# Altium project PCB_Project.PrjPcb
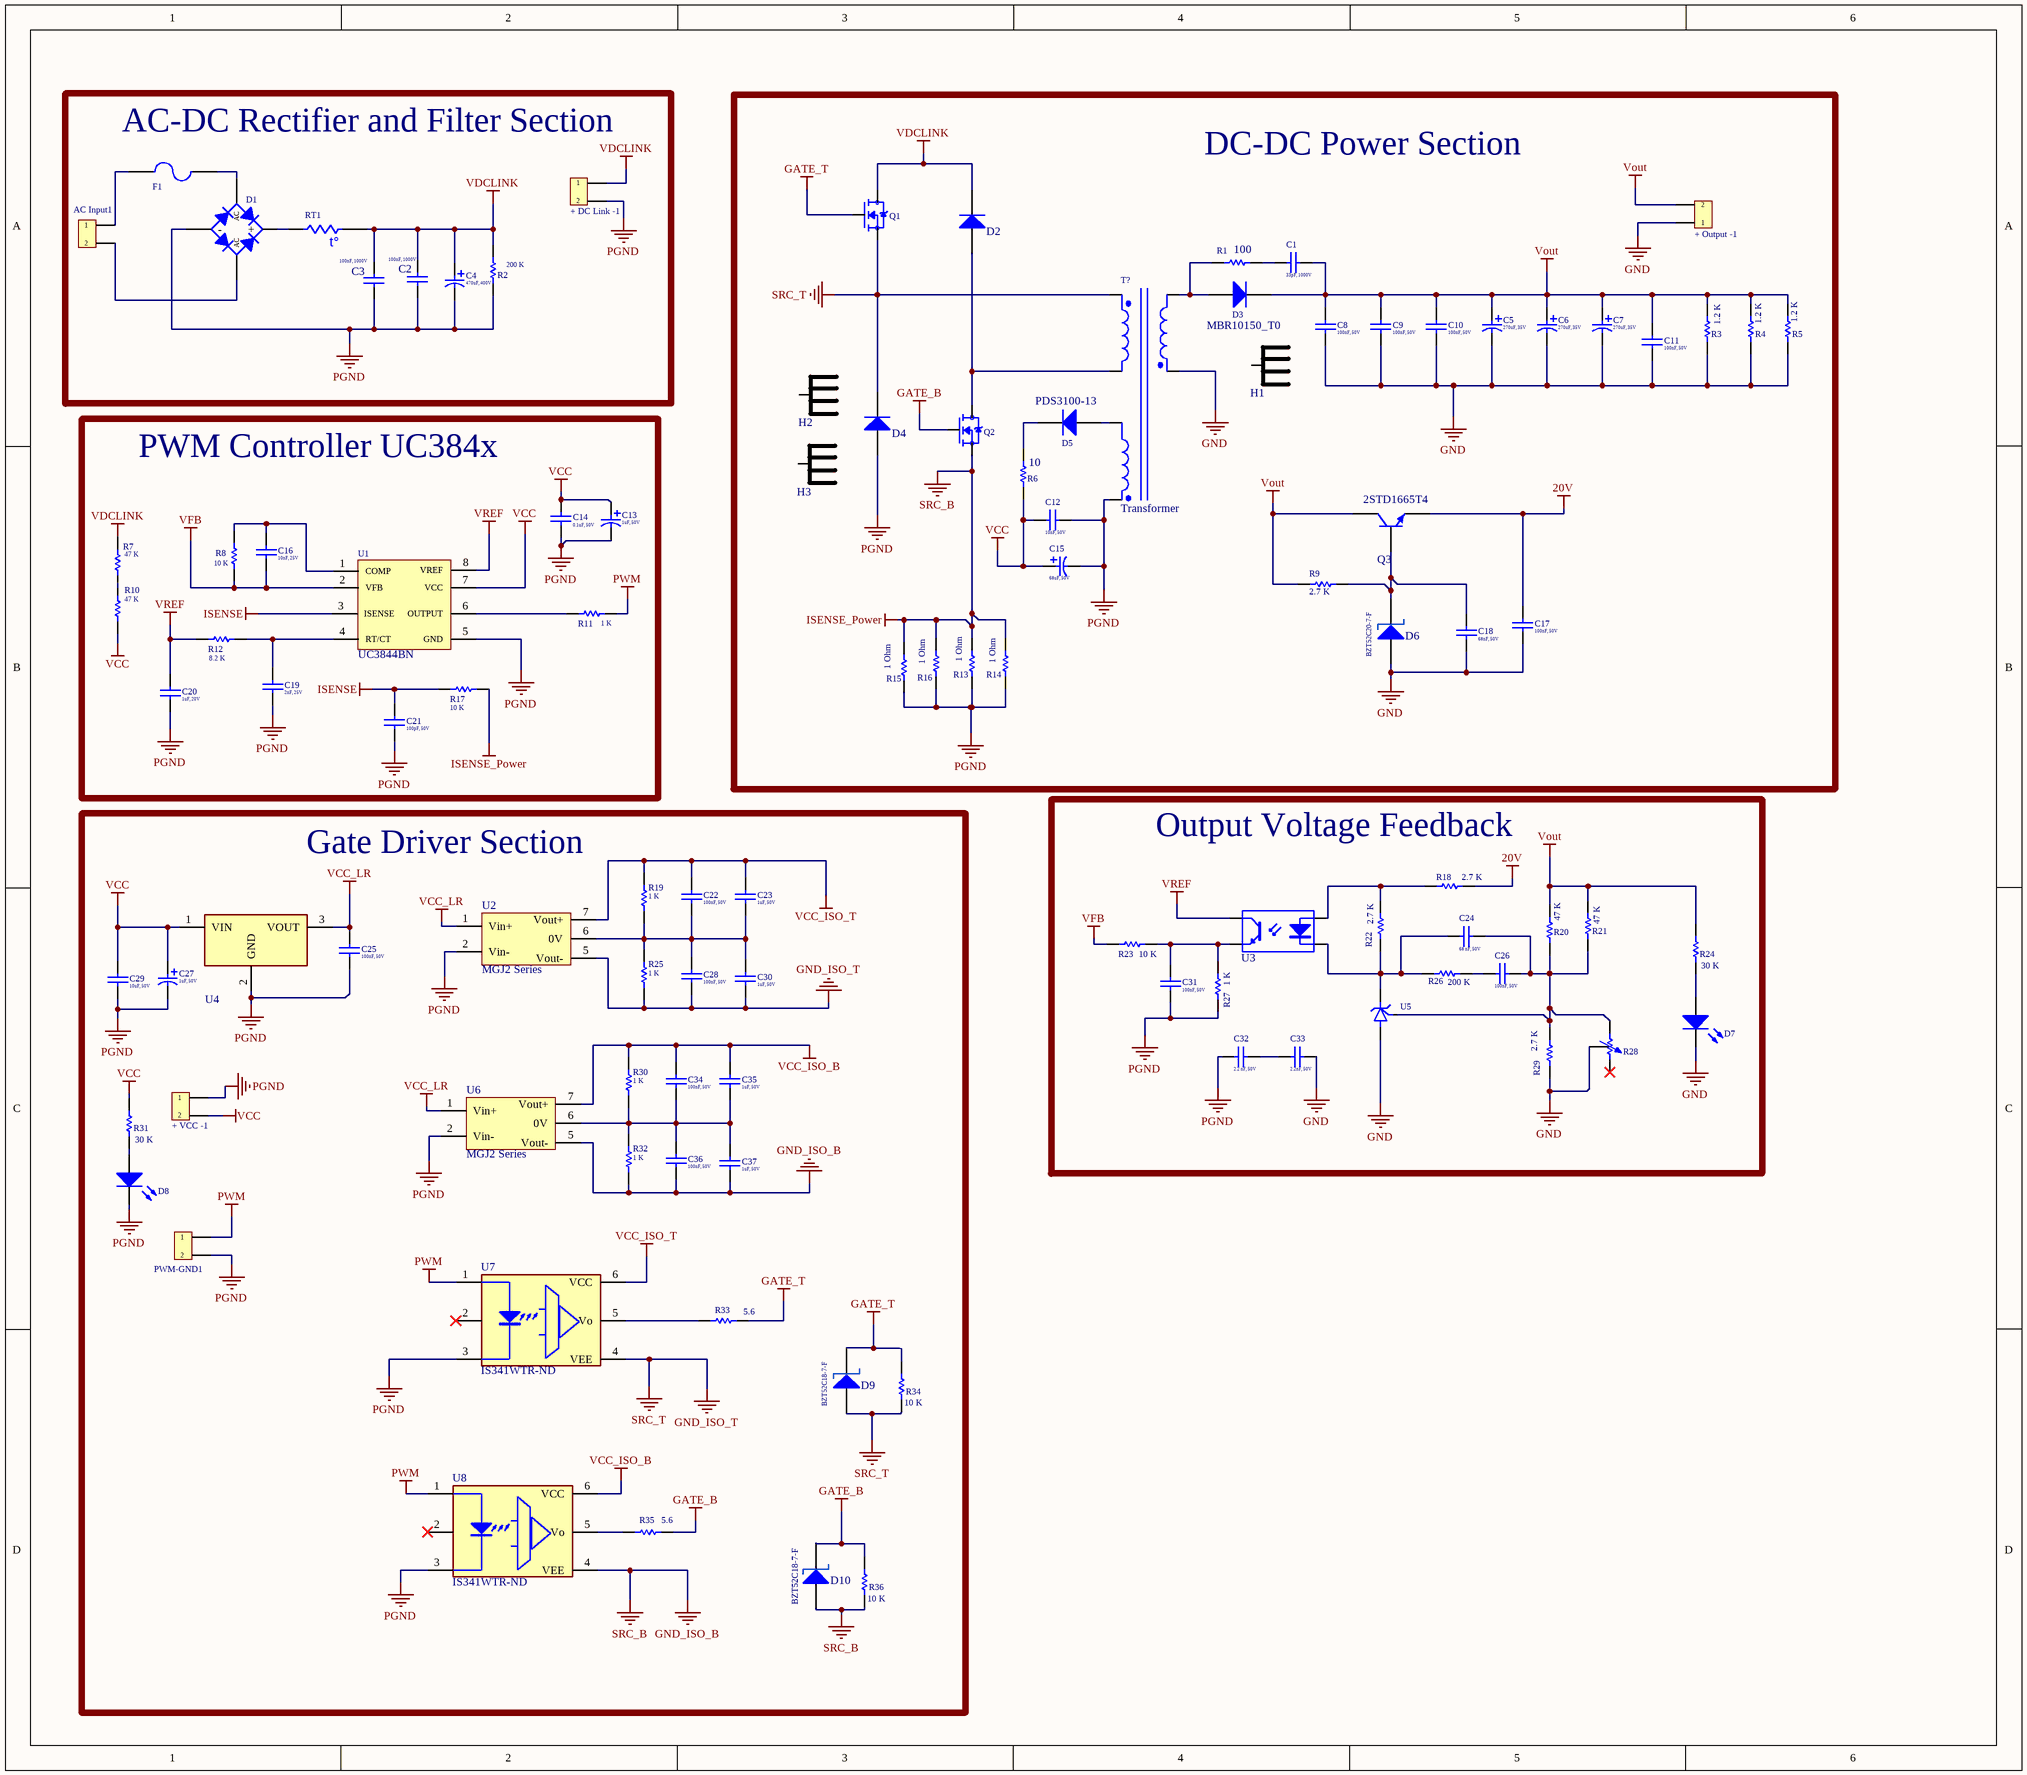
[diagram p0: Sheet1.SchDoc]
1 sheet, 105 parts. Net scope: global (net labels, ports and power ports of the same name join across sheets).
Board file: PCBV2.PcbDoc

## Sheet Sheet1.SchDoc
size 400 x 350 mm; SheetNumber: 1; SheetTotal: 1

### Parts
+_DC_Link_-1  732-2088-ND  [Connector 1x3 5.08mm]  (value not drawn)
+_Output_-1  732-2088-ND  [Connector 1x2 5.08mm]  (value not drawn)
+_VCC_-1  732-2088-ND  [Connector 1x2 5.08mm]  (value not drawn)
AC_Input1  732-2088-ND  [Connector 1x3 5.08mm]  (value not drawn)
C1  value 33pF, 1000V  [Capacitor Polyester High Voltage DIP]  (hidden comment: (DIGIKEY Part Number))
C2  value 100nF, 1000V  [Capacitor Film DIP 04]  (hidden comment: CBB23)
C3  value 100nF, 1000V  [Capacitor Film DIP 04]  (hidden comment: CBB23)
C4  value 470uF, 400V  [Capacitor Aluminum Electrolytic DIP 20*36.5*10]  (hidden comment: 493-2587-ND)
C5  value 270uF, 35V  [Capacitor Aluminum Electrolytic DIP 10*13*5]  (hidden comment: UHV1V271MPD1TA-ND)
C6  value 270uF, 35V  [Capacitor Aluminum Electrolytic DIP 10*13*5]  (hidden comment: UHV1V271MPD1TA-ND)
C7  value 270uF, 35V  [Capacitor Aluminum Electrolytic DIP 10*13*5]  (hidden comment: UHV1V271MPD1TA-ND)
C8  value 100nF, 50V  [Capacitor Ceramic SMD 1206]  (hidden comment: 478-KGM21NR71H104JTTR-ND)
C9  value 100nF, 50V  [Capacitor Ceramic SMD 1206]  (hidden comment: 478-KGM21NR71H104JTTR-ND)
C10  value 100nF, 50V  [Capacitor Ceramic SMD 1206]  (hidden comment: 478-KGM21NR71H104JTTR-ND)
C11  value 100nF, 50V  [Capacitor Film DIP 06]  (hidden comment: 478-KGM21NR71H104JTTR-ND)
C12  value 10nF, 50V  [Capacitor Ceramic SMD 805]  (hidden comment: GRM2195C1H103JA01D)
C13  value 1uF, 50V  [Capacitor Aluminum Electrolytic DIP 5*7.5*2.5]  (hidden comment: 732-8851-1-ND)
C14  value 0.1uF, 50V  [Capacitor Ceramic SMD 805]  (hidden comment: 399-C0805C104J5RAC7800TR-ND)
C15  value 68uF, 50V  [Capacitor Aluminum Electrolytic DIP 5*7.5*2.5]  (hidden comment: P15139-ND)
C16  value 10nF, 25V  [Capacitor Ceramic SMD 805]  (hidden comment: 490-1642-2-ND)
C17  value 100nF, 50V  [Capacitor Ceramic SMD 805]  (hidden comment: 478-KGM21NR71H104JTTR-ND)
C18  value 68nF, 50V  [Capacitor Ceramic SMD 805]  (hidden comment: KGM21NR71H683JT)
C19  value 2nF, 25V  [Capacitor Ceramic SMD 805]  (hidden comment: 490-1627-2-ND)
C20  value 1uF, 20V  [Capacitor Ceramic SMD 805]  (hidden comment: 311-3498-2-ND)
C21  value 100pF, 50V  [Capacitor Ceramic SMD 805]  (hidden comment: 399-C0805C101J5GAC7800TR-ND)
C22  value 100nF, 50V  [Capacitor Ceramic SMD 805]  (hidden comment: C0805C104J5RAC7800)
C23  value 1uF, 50V  [Capacitor Ceramic SMD 805]  (hidden comment: CC0805JKX7R9BB105)
C24  value 68 nF, 50V  [Capacitor Ceramic SMD 805]  (hidden comment: KGM21NR71H683JT)
C25  value 100nF, 50V  [Capacitor Ceramic SMD 805]  (hidden comment: C0805C104J5RAC7800)
C26  value 100nF, 50V  [Capacitor Ceramic SMD 805]  (hidden comment: C0805C104J5RAC7800)
C27  value 1uF, 50V  [Capacitor Aluminum Electrolytic DIP 5*7.5*2.5]  (hidden comment: 732-8851-1-ND)
C28  value 100nF, 50V  [Capacitor Ceramic SMD 805]  (hidden comment: C0805C104J5RAC7800)
C29  value 10uF, 50V  [Capacitor Ceramic SMD 805]  (hidden comment: 490-18663-2-ND)
C30  value 1uF, 50V  [Capacitor Ceramic SMD 805]  (hidden comment: CC0805JKX7R9BB105)
C31  value 100nF, 50V  [Capacitor Ceramic SMD 805]  (hidden comment: C0805C104J5RAC7800)
C32  value 2.2 nF, 50V  [Capacitor Polyester High Voltage DIP]  (hidden comment: (DIGIKEY Part Number))
C33  value 2.2nF, 50V  [Capacitor Polyester High Voltage DIP]  (hidden comment: (DIGIKEY Part Number))
C34  value 100nF, 50V  [Capacitor Ceramic SMD 805]  (hidden comment: C0805C104J5RAC7800)
C35  value 1uF, 50V  [Capacitor Ceramic SMD 805]  (hidden comment: CC0805JKX7R9BB105)
C36  value 100nF, 50V  [Capacitor Ceramic SMD 805]  (hidden comment: C0805C104J5RAC7800)
C37  value 1uF, 50V  [Capacitor Ceramic SMD 805]  (hidden comment: CC0805JKX7R9BB105)
D1  31-GBU10V08-TU-ND  [Bridge Rectifier 1Phase 600V 10A GBJ]  (value not drawn)
D2  DSEP6-06AS-TRL  [Diode SMD TO-252 (DPAK)]  (value not drawn)
D3  MBR10150_T0  [Diode DIP ITO-220AC]
D4  DSEP6-06AS-TRL  [Diode SMD TO-252 (DPAK)]  (value not drawn)
D5  PDS3100-13  [Diode SMD POWERDI5]
D6  BZT52C20-7-F  [Diode Zener SMD DO-214AC]
D7  L62505TR-ND  [LED SMD 805 01]  (value not drawn)
D8  L62505TR-ND  [LED SMD 805 01]  (value not drawn)
D9  BZT52C18-7-F  [Diode Zener SMD DO-214AC]
D10  BZT52C18-7-F  [Diode Zener SMD DO-214AC]
F1  F1730-ND  [Fuse Full DIP 02]  (value not drawn)
H1  (DIGIKEY Part Number)  [HEATSINK 05]  (value not drawn)
H2  (DIGIKEY Part Number)  [HEATSINK 05]  (value not drawn)
H3  (DIGIKEY Part Number)  [HEATSINK 05]  (value not drawn)
PWM-GND1  A105225-ND  [Header 01 1x2]  (value not drawn)
Q1  IPP50R280CEXKSA1-ND  [MOSFET DIP TO-220]  (value not drawn)
Q2  IPP50R280CEXKSA1-ND  [MOSFET DIP TO-220]  (value not drawn)
Q3  2STD1665T4  [BJT NPN SMD DPAK TO-252]
R1  value 100  [Resistor DIP 0.25W 01]  (hidden comment: (DIGIKEY Part Number))
R2  value 200 K  [Resistor DIP 0.25W 01]  (hidden comment: P200KDATR-ND)
R3  value 1.2 K  [Resistor SMD 1206]  (hidden comment: RMCF2010JT1K20)
R4  value 1.2 K  [Resistor SMD 1206]  (hidden comment: RMCF2010JT1K20)
R5  value 1.2 K  [Resistor SMD 1206]  (hidden comment: RMCF2010JT1K20)
R6  value 10  [Resistor SMD 805]  (hidden comment: (DIGIKEY Part Number))
R7  value 47 K  [Resistor SMD 805]  (hidden comment: P47KDATR-ND)
R8  value 10 K  [Resistor SMD 805]  (hidden comment: RG20P10.0KBTR-ND)
R9  value 2.7 K  [Resistor SMD 805]  (hidden comment: P2.7KDATR-ND)
R10  value 47 K  [Resistor SMD 805]  (hidden comment: P47KDATR-ND)
R11  value 1 K  [Resistor SMD 805]  (hidden comment: TC0525B1001T5G)
R12  value 8.2 K  [Resistor SMD 805]  (hidden comment: TC0550D8201T5F)
R13  value 1 Ohm  [Resistor SMD 2512]  (hidden comment: 13-RT1206BRE071RL-ND)
R14  value 1 Ohm  [Resistor SMD 2512]  (hidden comment: 13-RT1206BRE071RL-ND)
R15  value 1 Ohm  [Resistor SMD 2512]  (hidden comment: 13-RT1206BRE071RL-ND)
R16  value 1 Ohm  [Resistor SMD 2512]  (hidden comment: 13-RT1206BRE071RL-ND)
R17  value 10 K  [Resistor SMD 805]  (hidden comment: RG20P10.0KBTR-ND)
R18  value 2.7 K  [Resistor SMD 805]  (hidden comment: P2.7KDATR-ND)
R19  value 1 K  [Resistor SMD 805]  (hidden comment: TC0525B1001T5G)
R20  value 47 K  [Resistor SMD 805]  (hidden comment: ERA-6AEB473V)
R21  value 47 K  [Resistor SMD 805]  (hidden comment: ERA-6AEB473V)
R22  value 2.7 K  [Resistor SMD 805]  (hidden comment: P2.7KDATR-ND)
R23  value 10 K  [Resistor SMD 805]  (hidden comment: RG20P10.0KBTR-ND)
R24  value 30 K  [Resistor SMD 805]  (hidden comment: ERJ-P06F3002V-)
R25  value 1 K  [Resistor SMD 805]  (hidden comment: TC0525B1001T5G)
R26  value 200 K  [Resistor SMD 805]  (hidden comment: P200KDATR-ND)
R27  value 1 K  [Resistor SMD 805]  (hidden comment: ERA-6AEB102V)
R28  (DIGIKEY Part Number)  [Resistor Variable DIP 02]  (value not drawn)
R29  value 2.7 K  [Resistor SMD 805]  (hidden comment: ERA-6AEB272V)
R30  value 1 K  [Resistor SMD 805]  (hidden comment: TC0525B1001T5G)
R31  value 30 K  [Resistor SMD 805]  (hidden comment: ERJ-P06F3002V-)
R32  value 1 K  [Resistor SMD 805]  (hidden comment: TC0525B1001T5G)
R33  value 5.6  [Resistor SMD 1206 MELF 01]  (hidden comment: 749-1374-2-ND)
R34  value 10 K  [Resistor SMD 805]  (hidden comment: RG2012P-103-B-T5)
R35  value 5.6  [Resistor SMD 1206 MELF 01]  (hidden comment: 749-1374-2-ND)
R36  value 10 K  [Resistor SMD 805]  (hidden comment: RG2012P-103-B-T5)
RT1  118-BN-LG10Y2R0MYB-ND  [NTC Thermistor DIP 01]  (value not drawn)
T?  Transformer  [CustomTransformer-ELE713]
U1  UC3844BN  [PWM Controller UC3844 DIP 01]
U2  MGJ2 Series  [Linear Regulator Isolated Module DC-DC DIP 02]
U3  PS2501-1-H-A  [Optoisolators DIP 01]  (value not drawn)
U4  LM2940SX-12/NOPBTR-ND  [D2PAK]  (value not drawn)
U5  (DIGIKEY Part Number)  [TL431 DIP]  (value not drawn)
U6  MGJ2 Series  [Linear Regulator Isolated Module DC-DC DIP 02]
U7  IS341WTR-ND  [Gate Driver IS341W SO6 Stretched]
U8  IS341WTR-ND  [Gate Driver IS341W SO6 Stretched]

### Blocks framed on the sheet
AC-DC Rectifier and Filter Section: +_DC_Link_-1 AC_Input1 C2-C4 D1 F1 R2 RT1
DC-DC Power Section: +_Output_-1 C1 C5-C12 C15 C17 C18 D2-D6 H1-H3 Q1-Q3 R1 R3-R6 R9 R13-R16 T?
PWM Controller UC384x: C13 C14 C16 C19-C21 R7 R8 R10-R12 R17 U1
Gate Driver Section: +_VCC_-1 C22 C23 C25 C27-C30 C34-C37 D8-D10 PWM-GND1 R19 R25 R30-R36 U2 U4 U6-U8
Output Voltage Feedback: C24 C26 C31-C33 D7 R18 R20-R24 R26-R29 U3 U5

### Nets
20V: C17.2 Q3.2(E) R18.1
GATE_B: D10.2(K) Q2.1(G) R35.1 R36.1
GATE_T: D9.2(K) Q1.1(G) R33.1 R34.1
GND: +_Output_-1.1 C5.2 C6.2 C7.2 C8.1 C9.1 C10.1 C11.1 C17.1 C18.1 C33.2 D6.1(A) D7.2(K) R3.2 R4.2 R5.2 R28.2 R29.2 T?.6 U5.2(A)
GND_ISO_B: C36.1 C37.1 D10.1(A) Q2.3(S) R13.2 R14.2 R15.2 R16.2 R17.1 R32.1 R36.2 U6.5(Vout-) U8.4(VEE)  [also labelled ISENSE_Power, SRC_B]
GND_ISO_T: C28.1 C30.1 D4.2(K) D9.1(A) Q1.3(S) R25.1 R34.2 T?.1 U2.5(Vout-) U7.4(VEE)  [also labelled SRC_T]
ISENSE: C21.2 R17.2 U1.3(ISENSE)
PGND: +_DC_Link_-1.2 +_VCC_-1.1 C2.1 C3.1 C4.2 C12.1 C13.2 C14.1 C15.2 C19.1 C20.1 C21.1 C25.1 C27.2 C29.1 C31.2 C32.1 D1.3(-) D4.1(A) D8.2(K) PWM-GND1.2 R2.2 R13.1 R14.1 R15.1 R16.1 R27.2 T?.4 U1.5(GND) U2.2(Vin-) U4.2(GND) U6.2(Vin-) U7.3 U8.3
PWM: PWM-GND1.1 R11.2 U7.1 U8.1
VCC: +_VCC_-1.2 C12.2 C13.1 C14.2 C15.1 C27.1 C29.2 R6.2 R10.2 R31.1 U1.7(VCC) U4.1(VIN)
VCC_ISO_B: C34.2 C35.2 R30.2 U6.7(Vout+) U8.6(VCC)
VCC_ISO_T: C22.2 C23.2 R19.2 U2.7(Vout+) U7.6(VCC)
VCC_LR: C25.2 U2.1(Vin+) U4.3(VOUT) U6.1(Vin+)
VDCLINK: +_DC_Link_-1.1 C2.2 C3.2 C4.1 D2.2(K) Q1.2(D) R2.1 R7.1 RT1.2
VFB: C16.1 R8.1 R23.1 U1.2(VFB)
Vout: +_Output_-1.2 C1.1 C5.1 C6.1 C7.1 C8.2 C9.2 C10.2 C11.2 D3.2(K) Q3.3(C) R3.1 R4.1 R5.1 R9.1 R20.1 R21.1 R24.1
VREF: C20.2 R12.2 U1.8(VREF) U3.4(C)
NetAC_Input1_1: AC_Input1.1 F1.1
NetAC_Input1_2: AC_Input1.2 D1.2(AC)
NetC1_2: C1.2 R1.1
NetC16_2: C16.2 R8.2 U1.1(COMP)
NetC18_2: C18.2 D6.2(K) Q3.1(B) R9.2
NetC19_2: C19.2 R12.1 U1.4(RT/CT)
NetC22_1: C22.1 C23.1 C28.2 C30.2 R19.1 R25.2 U2.6(0V)
NetC24_1: C24.1 C26.1 R20.2 R21.2 R28.1 R29.1 U5.1(REF)
NetC24_2: C24.2 R22.2 R26.1 U3.2(K) U5.3(C)
NetC26_2: C26.2 R26.2
NetC31_1: C31.1 R23.2 R27.1 U3.3(E)
NetC32_2: C32.2 C33.1
NetC34_1: C34.1 C35.1 C36.2 C37.2 R30.1 R32.2 U6.6(0V)
NetD1_1: D1.1(AC) F1.2
NetD1_4: D1.4(+) RT1.1
NetD2_1: D2.1(A) Q2.2(D) T?.2
NetD3_1: D3.1(A) R1.2 T?.5
NetD5_1: D5.1(A) T?.3
NetD5_2: D5.2(K) R6.1
NetD7_1: D7.1(A) R24.2
NetD8_1: D8.1(A) R31.2
NetR7_2: R7.2 R10.1
NetR11_1: R11.1 U1.6(OUTPUT)
NetR18_2: R18.2 R22.1 U3.1(A)
NetR33_2: R33.2 U7.5(Vo)
NetR35_2: R35.2 U8.5(Vo)

Not connected (* = marked no-connect by the designer): R28 3*; U7 2*; U8 2*

### Notes on the sheet
- (in symbol NTC) t°

### Library data of the parts
+_DC_Link_-1 +_Output_-1 +_VCC_-1 AC_Input1 PWM-GND1 = Contact-Phoenix 2x: Manufacturer: Phoenix Contact; Manufacturer Part Number: 1715721; Max Current Rating: 22A; Number of Poles: 2; Voltage Rating: 400V; Max Supply Voltage: 250V; Current Rating: 17.5A; Number of Levels: 1; Current: 15A; Voltage: 300V; Connector Type: Screw,Terminal Block,PCB; Test Voltage: 4kV; Wire Gauge (Max): 26AWG; Wire/Cable Gauge: 14AWG; Pitch: 5.08mm; Stripping Length: 7mm; Approvals: UL,CSA,cULus,EAC; Supplier 1: Digi-Key; RoHS: Yes; Category: Terminal Blocks; Stock 1: 4962; Pricing 1: 1=1.39000, 10=1.33400, 50=1.27600, 100=1.24120, 250=1.16000, 500=1.06720, 1000=0.98600, 2500=0.93960, 5000=0.89320 (USD); Mount: Through Hole; Number of Pins: 2; Color: Green; Weight: 0.103705oz; Housing Color: Green; Housing Material: Polyamide; Insulation Material: Nylon; Contact Material: Tin; Min Operating Temperature: -20°C; Max Operating Temperature: 100°C; Number of Rows: 1; Package Quantity: 50; Voltage Rating (AC): 250V; Packaging: Bulk; Number of Positions: 2; Termination: Screw; Number of Positions Per Level: 2; Number of Contacts: 2; Number of Circuits: 2; Orientation: Straight; Series: MKDS; Length: 10.16mm; Width: 17.3mm; Height: 17.3mm; Wire Gauge (Min): 26AWG; Depth: 9.8mm; Radiation Hardening: No; REACH SVHC: No SVHC; Lead Free: Lead Free; Flammability Rating: UL94 V-0; RoHS Compliant: Yes; ComponentLink1URL: https://datasheet.ciiva.com/16046/1715721-16046034.pdf?src-supplier=Onlinecomponents.com; ComponentLink1Description: https://datasheet.ciiva.com/16046/1715721-16046034.pdf?src-supplier=Onlinecomponents.com; ComponentLink2URL: https://datasheet.ciiva.com/1120/1697161-1120393.pdf?src-supplier=Farnell; ComponentLink2Description: https://datasheet.ciiva.com/1120/1697161-1120393.pdf?src-supplier=Farnell; ComponentLink3URL: https://datasheet.ciiva.com/15169/getdatasheetpartid-212174-15169929.pdf?src-supplier=Verical; ComponentLink3Description: https://datasheet.ciiva.com/15169/getdatasheetpartid-212174-15169929.pdf?src-supplier=Verical; ComponentLink4URL: https://datasheet.ciiva.com/832/1715721-832095.pdf?src-supplier=Digi-Key; ComponentLink4Description: https://datasheet.ciiva.com/832/1715721-832095.pdf?src-supplier=Digi-Key; Supplier Part Number 1: 277-1263-ND
C1-C3 C8-C12 C14 C16-C26 C28-C37 = Capacitors Non-Electrolytic: Ceramic & Polyester Capacitor
C4-C7 C13 C15 C27 = Capacitors Electrolytic: Aluminum Electrolytic Capacitors; MF: Nichicon; MP: UVR2A471MHD; Price: None; Package: Radial Nichicon; SnapEDA_Link: https://www.snapeda.com/parts/UVR2A471MHD/Nichicon/view-part/2302933/?ref=snap; Availability: Unavailable; Supplier 1: Digi-Key; Supplier Part Number 1: 1189-2012-ND
D1 = Single Phase Bridge Rectifier: Bridge Rectifier Single Phase Standard; Published: 8-Jun-2000; LatestRevisionDate: 29-May-2009; LatestRevisionNote: Sch pins A & K swapped.; DatasheetVersion: E2732B; PackageReference: D-38; Publisher: Altium Limited; PackageDescription: Bridge Rectifier; 4 Terminals; Body 9.4 x 9.4 mm (typ); Pitch 5.08 mm; Supplier 1: Future Electronics; Supplier Part Number 1: 6113720
D2-D5 = Diode: Through Hole & SMD Diode; Published: 8-Jun-2000; LatestRevisionDate: 17-Jul-2002; LatestRevisionNote: Re-released for DXP Platform.; DatasheetVersion: Aug-1984; PackageReference: DO-201AD; Publisher: Altium Limited; PackageDescription: Diode, Axial; Body 9.5 x 5.3 mm (LxDia. max), Lead Dia. 1.32 mm (max); ComponentLink1Description: Manufacturer Link; ComponentLink1URL: http://www.irf.com/
D6 D9 D10 = Diode Zener: Through Hole & SMD Zener Diode; Note: Terminal 2 is the TAB and is electrically connected to the cathode; Published: 8-Jun-2000; LatestRevisionDate: 17-Jul-2002; LatestRevisionNote: Re-released for DXP Platform.; DatasheetVersion: Dec-1997; PackageVersion: Feb-1998; PackageReference: TO-220AC; Publisher: Altium Limited; PackageDescription: TO, Thru-Hole, Vertical, Heatsink Mounted; 3 In-Line Leads (1 Absent); Pitch 2.54 mm; ComponentLink1Description: Manufacturer Link; ComponentLink1URL: http://www.irf.com/; ComponentLink2Description: Datasheet; ComponentLink2URL: http://www.irf.com/product-info/datasheets/data/18tq.pdf
D7 D8 = LED: Typical RED, GREEN, YELLOW, AMBER GaAs LED; Published: 8-Jun-2000; LatestRevisionDate: 17-Jul-2002; LatestRevisionNote: Re-released for DXP Platform.; PackageVersion: Feb-2002; PackageReference: 3.2X1.6X1.1; Publisher: Altium Limited; PackageDescription: SM LED; 2 Flat Leads
F1 = Fuse: Fuse, Circuit Protection; Published: 8-Jun-2000; LatestRevisionDate: 17-Jul-2002; LatestRevisionNote: Re-released for DXP Platform.; PackageReference: PIN-W2/E2.8; Publisher: Altium Limited; PackageDescription: Thru-Hole; 2 Leads; Supplier 1: Digi-Key; Supplier Part Number 1: 031501.2HXP-ND
H1-H3 = Heat Sink: Heat Sink TO-220 Aluminum 20.0W @ 60Â°C Board Level, Vertical; MP: 530002B02500G; MF: Aavid Thermalloy; Value: *; SnapEDA_Link: https://www.snapeda.com/parts/530002B02500G/Aavid+Thermalloy/view-part/?ref=snap; Purchase-URL: https://pricing.snapeda.com/search/part/530002B02500G/?ref=eda; Check_prices: https://www.snapeda.com/parts/530002B02500G/Aavid+Thermalloy/view-part/?ref=eda; Availability: In Stock; Price: None; Package: None
Q1 Q2 = Transistor MOSFET: N-Channel MOSFET; MP: FDN360P; MF: ON Semiconductor; Check_prices: https://www.snapeda.com/parts/FDN360P/ON%20Semiconductor/view-part/2105995/?ref=eda; Price: None; Purchase-URL: https://pricing.snapeda.com/search/part/FDN360P/?ref=eda; Availability: Good; Package: SC-59 ON Semiconductor; SnapEDA_Link: https://www.snapeda.com/parts/FDN360P/ON%20Semiconductor/view-part/2105995/?ref=snap; Value: *
Q3 = Transistor BJT: NPN General Purpose BJT; Published: 8-Jun-2000; LatestRevisionDate: 15-Jan-2003; LatestRevisionNote: PCB Footprint 'BCY-W3/D4.7' replaced; DatasheetVersion: 1997; PackageVersion: Sep-1998; PackageReference: TO-92A; Publisher: Altium Limited; PackageDescription: TO, Flat Index; 3 In-Line, Axial Leads; Body Dia. 4.5mm; Leads 0.51 x 0.48 mm (max); ComponentLink1Description: Manufacturer Link; ComponentLink1URL: http://www.fairchildsemi.com/; ComponentLink2Description: Datasheet; ComponentLink2URL: http://www.fairchildsemi.com/ds/2N%2F2N3904.pdf
R1-R27 R29-R36 = Resistor: Through Hole & SMD; Published: 8-Jun-2000; LatestRevisionDate: 17-Jul-2002; LatestRevisionNote: Re-released for DXP Platform.; PackageReference: AXIAL-0.3; Publisher: Altium Limited; PackageDescription: Axial Device, Thru-Hole; 2 Leads; 0.3 in Pin Spacing
R28 = Resistor Variable: Trimmer Potentiometer Cermet Top Adjustment; Set Position: 0.5; Value: 20K; Published: 8-Jun-2000; LatestRevisionDate: 17-Jul-2002; LatestRevisionNote: Re-released for DXP Platform.; PackageReference: AXIAL-0.7; Publisher: Altium Limited; PackageDescription: Axial Device, Thru-Hole; 2 Leads; 0.7 in Pin Spacing; Supplier 1: Digi-Key; Supplier Part Number 1: 3252W-103LF-ND
RT1 = NTC: NTC Thermistor; Published: 24-Mar-1999; LatestRevisionDate: 29-May-2009; LatestRevisionNote: IPC-7351 Footprint Added.; PackageVersion: Mar-2003; PackageReference: 6-0805; Publisher: Altium Limited; PackageDescription: Chip Resistor 0805 Case Size; Code_IPC: RESC2012; Supplier 1: Digi-Key; Supplier Part Number 1: 495-76311-ND
T? = EE42/21/20: Custom Transformer; Published: 25-Jan-2001; LatestRevisionDate: 17-Jul-2002; LatestRevisionNote: Re-released for DXP Platform.; PackageReference: TRF_8; Publisher: Altium Limited; PackageDescription: Transformer; 8 Leads
U1 = PWM Controller UC3844BN: Off-Line Controllers 52kHz 1A Current PWM No-Cancel/No-Return; Manufacturer: STMicroelectronics; Supplier: Mouser; Supplier Part Number: 511-UC3844BN; Manufacturer Part Number: UC3844BN; RoHS: Yes; Category: Voltage Regulators - Switching; Stock: 11981; Pricing: 1=0.71, 10=0.501, 50=0.501, 100=0.46, 1000=0.414, 10000=0.38 (USD); ComponentLink1URL: https://datasheet.ciiva.com/15108/getdatasheetpartid-119240-15108173.pdf?src-supplier=Verical; ComponentLink1Description: https://datasheet.ciiva.com/15108/getdatasheetpartid-119240-15108173.pdf?src-supplier=Verical; ComponentLink2URL: https://datasheet.ciiva.com/4875/cd00000966-105506-4875760.pdf?src-supplier=Mouser; ComponentLink2Description: https://datasheet.ciiva.com/4875/cd00000966-105506-4875760.pdf?src-supplier=Mouser; ComponentLink3URL: https://datasheet.ciiva.com/17091/0900766b80ed226c-17091155.pdf?src-supplier=Allied+Electronics; ComponentLink3Description: https://datasheet.ciiva.com/17091/0900766b80ed226c-17091155.pdf?src-supplier=Allied+Electronics; ComponentLink4URL: https://datasheet.ciiva.com/2015/cd00000966-2015458.pdf?src-supplier=Digikey; ComponentLink4Description: https://datasheet.ciiva.com/2015/cd00000966-2015458.pdf?src-supplier=Digikey; ComponentLink5URL: https://datasheet.ciiva.com/2015/cd00000966-2015459.pdf?src-supplier=Digikey; ComponentLink5Description: https://datasheet.ciiva.com/2015/cd00000966-2015459.pdf?src-supplier=Digikey; ComponentLink6URL: https://datasheet.ciiva.com/8197/cd00000966-8197558.pdf?src-supplier=Avnet; ComponentLink6Description: https://datasheet.ciiva.com/8197/cd00000966-8197558.pdf?src-supplier=Avnet; ComponentLink7URL: https://datasheet.ciiva.com/16361/cd00000966-16361433.pdf?src-supplier=Future+Electronics; ComponentLink7Description: https://datasheet.ciiva.com/16361/cd00000966-16361433.pdf?src-supplier=Future+Electronics
U2 U6 = Linear Regulator Isolated Module MGJ: Module DC-DC 12VIN 2-OUT 15V/-5V 0.08A/0.04A 2W 5-Pin SIP Module; Manufacturer: Murata; Manufacturer Part Number: MGJ2D121505SC; Max Input Voltage: 13.2V; Min Input Voltage: 10.8V; Number of Outputs: 2; Voltage - Output 1: 15V; Voltage - Output 2: -5V; Max Output Current: 40mA; Isolation Voltage: 5.2kV; Efficiency: 80%; Current - Output 1: 80mA; Nominal Input Voltage: 12V; Max Power Dissipation: 1W; Stock 1: 0; Pricing 1: 1=8.46, 5=8.42, 10=8.36, 25=8.27, 50=8.06, 100=7.66, 250=7.17, 500=6.68, 1000=6.65 (USD); Mount: Through Hole; Case/Package: SIP; Number of Pins: 5; Weight: 0.151678oz; Min Operating Temperature: -40°C; Max Operating Temperature: 100°C; Packaging: Rail/Tube; Output Power: 2W; Max Input Voltage (DC): 13.2V; Min Input Voltage (DC): 10.8V; Max Output Power: 2W; Current - Output 2: 40mA; Output Voltage: 15V; Output Current: 80mA; Package Quantity: 25; Features: SCP; Length: 0.77inch; Width: 0.39inch; Height: 0.5inch; Depth: 19.65mm; Radiation Hardening: No; REACH SVHC: No SVHC; RoHS Compliant: Yes; ComponentLink1URL: http://www.farnell.com/datasheets/1965123.pdf?src-supplier=Element14; ComponentLink1Description: http://www.farnell.com/datasheets/1965123.pdf?src-supplier=Element14; ComponentLink2URL: http://power.murata.com/data/power/ncl/kdc_mgj2.pdf?src-supplier=Avnet; ComponentLink2Description: http://power.murata.com/data/power/ncl/kdc_mgj2.pdf?src-supplier=Avnet; Supplier 1: Mouser; Supplier Part Number 1: 580-MGJ2D122005SC
U3 = Optoisolator: Optoisolator Transistor Output 5000Vrms 1 Channel 4-DIP; Published: 24-Mar-1999; LatestRevisionDate: 04-Mar-2005; LatestRevisionNote: Sch pins 3 & 4 Swapped.; DatasheetVersion: Nov-2003; PackageReference: DIP-4; Publisher: Altium Limited; Supplier 1: Digi-Key; Supplier Part Number 1: 559-1070-ND
U4 = Linear Regulator: Voltage Regulators - Linear, Low Drop Out (LDO) Regulators; Manufacturer: STMicroelectronics; Manufacturer Part Number: LD1117DT33; Dropout Voltage: 1.1V; Max Input Voltage: 15V; Output Current: 950mA; Number of Outputs: 1; Max Power Dissipation: 12W; Output Voltage: 3.3V; Min Input Voltage: 5.3V; Max Output Current: 800mA; Min Supply Voltage: 4.75V; Input Bias Current: 5mA; Polarity: Positive; Quiescent Current: 10mA; Output Voltage Accuracy: 1%; Output Type: Fixed; Supplier 1: Mouser; RoHS: Yes; Category: Voltage Regulators - Linear; Mount: Surface Mount; Case/Package: TO-252; Number of Pins: 3; Min Operating Temperature: 0°C; Max Operating Temperature: 125°C; Package Quantity: 75; Packaging: Rail/Tube; Max Supply Voltage: 15V; Nominal Output Voltage: 3.3V; Number of Regulators: 1; Power Dissipation: 12W; Max Output Voltage: 3.3V; Termination: SMD/SMT; Voltage: 3.3V; REACH SVHC: No SVHC; RoHS Compliant: Yes; ComponentLink1URL: https://datasheet.ciiva.com/2070/cd00000544-2070990.pdf?src-supplier=Digi-Key; ComponentLink1Description: https://datasheet.ciiva.com/2070/cd00000544-2070990.pdf?src-supplier=Digi-Key; Supplier Part Number 1: 511-LD1117DT33
U5 = TL431: Shunt Voltage Reference IC; MP: TL431ILP; MF: Microsemi Corporation; Availability: Unavailable; Price: None; Package: TO-92 Microsemi Corporation; DigiKey-Purchase-URL: https://snapeda.com/shop?store=DigiKey&id=187631; SnapEDA_Link: https://www.snapeda.com/parts/TL431ILP/Microsemi%20Corporation/view-part/187631/?ref=snap; Value: *; Supplier 1: Digi-Key; Supplier Part Number 1: 497-16221-ND
U7 U8 = Gate Driver IS341W: Photocoupler is ideally suited for driving power IGBTs and MOSFETs; Manufacturer: Isocom; Manufacturer Part Number: IS341W; Supplier: Digikey; Supplier Part Number: IS341WCT-ND; RoHS: Yes; Stock: 232; Pricing: 1=2.2, 10=1.429, 100=1.0327, 500=0.87664 (USD); ComponentLink1URL: http://isocom.com/wp-content/uploads/2017/08/DD93205_IS341W_17-01-17.pdf?src-supplier=Digikey; ComponentLink1Description: http://isocom.com/wp-content/uploads/2017/08/DD93205_IS341W_17-01-17.pdf?src-supplier=Digikey